# Altium project Organoid Sensing Silicon Wafer Design.PrjPcb
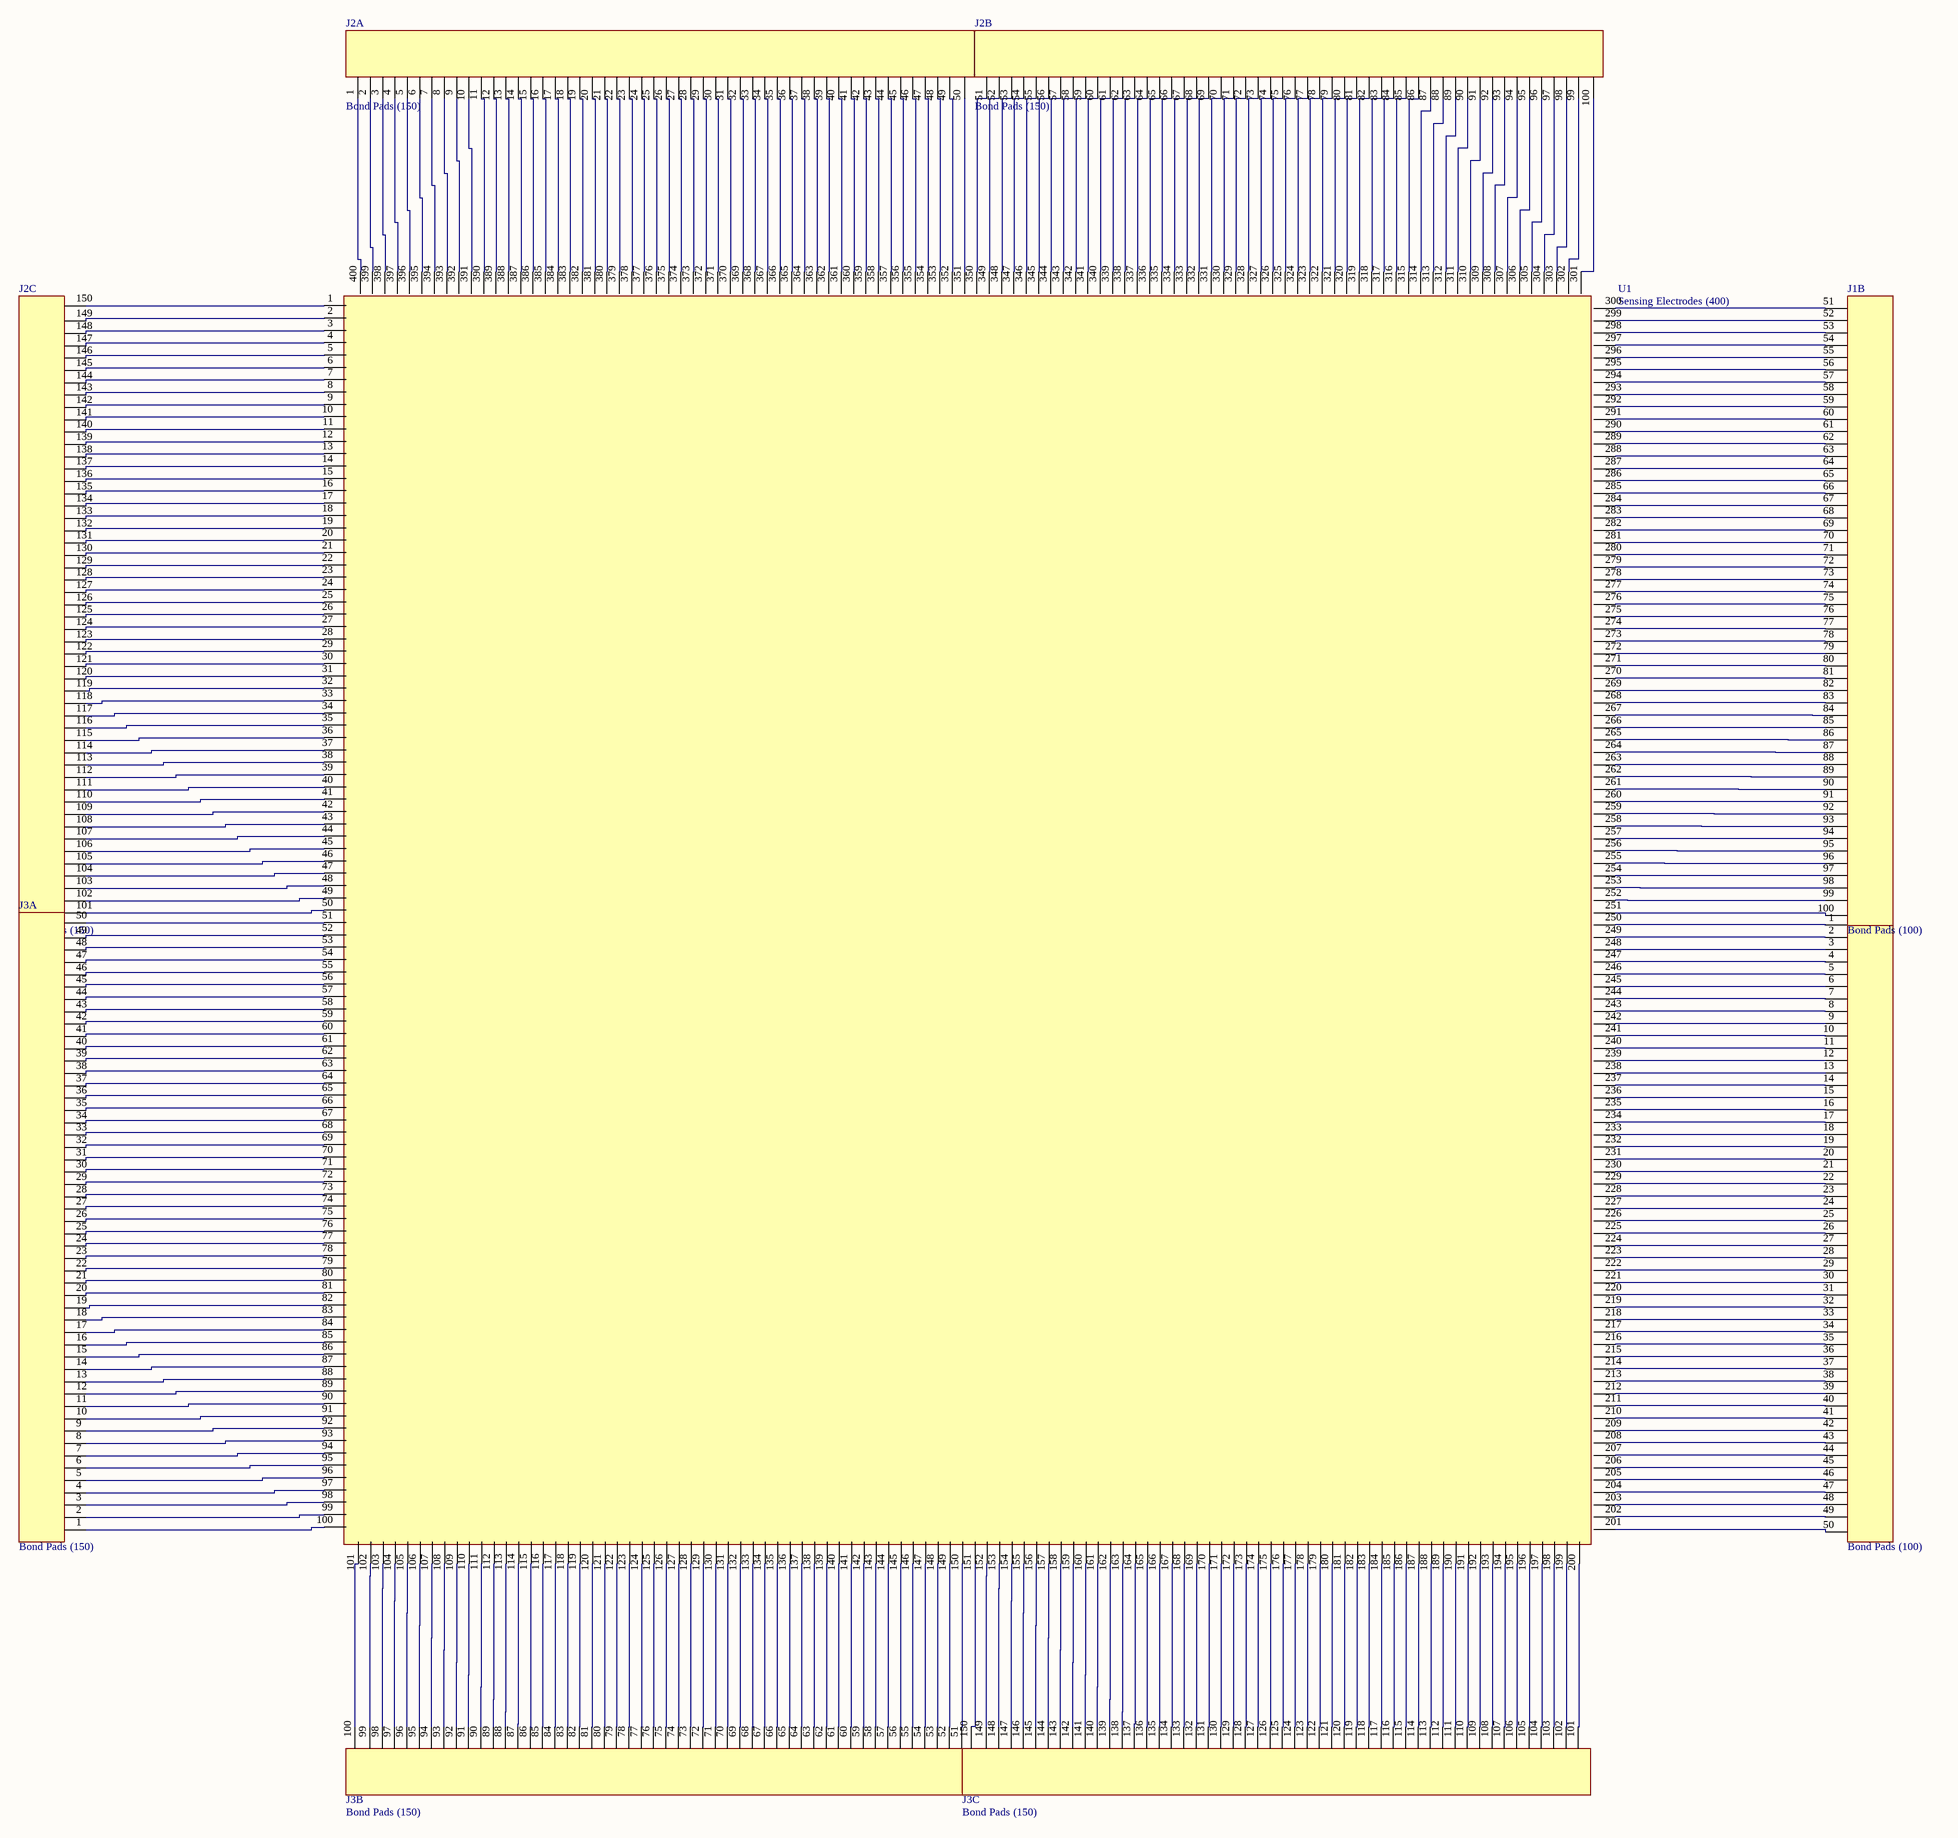
[diagram p0: Wafer Schematic.SchDoc]
1 sheet, 4 parts. Net scope: global (net labels, ports and power ports of the same name join across sheets).
Board file: WaferPCB.PcbDoc

## Sheet Wafer Schematic.SchDoc
size E; SheetNumber: 1; SheetTotal: 1

### Parts
J1  Bond Pads (100)  [BOND PADS (100)]  (parts A,B of 2)
J2  Bond Pads (150)  [BOND PADS (150)]  (parts A,B,C of 3)
J3  Bond Pads (150)  [BOND PADS (150)]  (parts A,B,C of 3)
U1  Sensing Electrodes (400)  [LGA400C100P20X20_2000X2000X0]

### Nets
NetJ1_1: J1.1 U1.250
NetJ1_2: J1.2 U1.249
NetJ1_3: J1.3 U1.248
NetJ1_4: J1.4 U1.247
NetJ1_5: J1.5 U1.246
NetJ1_6: J1.6 U1.245
NetJ1_7: J1.7 U1.244
NetJ1_8: J1.8 U1.243
NetJ1_9: J1.9 U1.242
NetJ1_10: J1.10 U1.241
NetJ1_11: J1.11 U1.240
NetJ1_12: J1.12 U1.239
NetJ1_13: J1.13 U1.238
NetJ1_14: J1.14 U1.237
NetJ1_15: J1.15 U1.236
NetJ1_16: J1.16 U1.235
NetJ1_17: J1.17 U1.234
NetJ1_18: J1.18 U1.233
NetJ1_19: J1.19 U1.232
NetJ1_20: J1.20 U1.231
NetJ1_21: J1.21 U1.230
NetJ1_22: J1.22 U1.229
NetJ1_23: J1.23 U1.228
NetJ1_24: J1.24 U1.227
NetJ1_25: J1.25 U1.226
NetJ1_26: J1.26 U1.225
NetJ1_27: J1.27 U1.224
NetJ1_28: J1.28 U1.223
NetJ1_29: J1.29 U1.222
NetJ1_30: J1.30 U1.221
NetJ1_31: J1.31 U1.220
NetJ1_32: J1.32 U1.219
NetJ1_33: J1.33 U1.218
NetJ1_34: J1.34 U1.217
NetJ1_35: J1.35 U1.216
NetJ1_36: J1.36 U1.215
NetJ1_37: J1.37 U1.214
NetJ1_38: J1.38 U1.213
NetJ1_39: J1.39 U1.212
NetJ1_40: J1.40 U1.211
NetJ1_41: J1.41 U1.210
NetJ1_42: J1.42 U1.209
NetJ1_43: J1.43 U1.208
NetJ1_44: J1.44 U1.207
NetJ1_45: J1.45 U1.206
NetJ1_46: J1.46 U1.205
NetJ1_47: J1.47 U1.204
NetJ1_48: J1.48 U1.203
NetJ1_49: J1.49 U1.202
NetJ1_50: J1.50 U1.201
NetJ1_51: J1.51 U1.300
NetJ1_52: J1.52 U1.299
NetJ1_53: J1.53 U1.298
NetJ1_54: J1.54 U1.297
NetJ1_55: J1.55 U1.296
NetJ1_56: J1.56 U1.295
NetJ1_57: J1.57 U1.294
NetJ1_58: J1.58 U1.293
NetJ1_59: J1.59 U1.292
NetJ1_60: J1.60 U1.291
NetJ1_61: J1.61 U1.290
NetJ1_62: J1.62 U1.289
NetJ1_63: J1.63 U1.288
NetJ1_64: J1.64 U1.287
NetJ1_65: J1.65 U1.286
NetJ1_66: J1.66 U1.285
NetJ1_67: J1.67 U1.284
NetJ1_68: J1.68 U1.283
NetJ1_69: J1.69 U1.282
NetJ1_70: J1.70 U1.281
NetJ1_71: J1.71 U1.280
NetJ1_72: J1.72 U1.279
NetJ1_73: J1.73 U1.278
NetJ1_74: J1.74 U1.277
NetJ1_75: J1.75 U1.276
NetJ1_76: J1.76 U1.275
NetJ1_77: J1.77 U1.274
NetJ1_78: J1.78 U1.273
NetJ1_79: J1.79 U1.272
NetJ1_80: J1.80 U1.271
NetJ1_81: J1.81 U1.270
NetJ1_82: J1.82 U1.269
NetJ1_83: J1.83 U1.268
NetJ1_84: J1.84 U1.267
NetJ1_85: J1.85 U1.266
NetJ1_86: J1.86 U1.265
NetJ1_87: J1.87 U1.264
NetJ1_88: J1.88 U1.263
NetJ1_89: J1.89 U1.262
NetJ1_90: J1.90 U1.261
NetJ1_91: J1.91 U1.260
NetJ1_92: J1.92 U1.259
NetJ1_93: J1.93 U1.258
NetJ1_94: J1.94 U1.257
NetJ1_95: J1.95 U1.256
NetJ1_96: J1.96 U1.255
NetJ1_97: J1.97 U1.254
NetJ1_98: J1.98 U1.253
NetJ1_99: J1.99 U1.252
NetJ1_100: J1.100 U1.251
NetJ2_1: J2.1 U1.400
NetJ2_2: J2.2 U1.399
NetJ2_3: J2.3 U1.398
NetJ2_4: J2.4 U1.397
NetJ2_5: J2.5 U1.396
NetJ2_6: J2.6 U1.395
NetJ2_7: J2.7 U1.394
NetJ2_8: J2.8 U1.393
NetJ2_9: J2.9 U1.392
NetJ2_10: J2.10 U1.391
NetJ2_11: J2.11 U1.390
NetJ2_12: J2.12 U1.389
NetJ2_13: J2.13 U1.388
NetJ2_14: J2.14 U1.387
NetJ2_15: J2.15 U1.386
NetJ2_16: J2.16 U1.385
NetJ2_17: J2.17 U1.384
NetJ2_18: J2.18 U1.383
NetJ2_19: J2.19 U1.382
NetJ2_20: J2.20 U1.381
NetJ2_21: J2.21 U1.380
NetJ2_22: J2.22 U1.379
NetJ2_23: J2.23 U1.378
NetJ2_24: J2.24 U1.377
NetJ2_25: J2.25 U1.376
NetJ2_26: J2.26 U1.375
NetJ2_27: J2.27 U1.374
NetJ2_28: J2.28 U1.373
NetJ2_29: J2.29 U1.372
NetJ2_30: J2.30 U1.371
NetJ2_31: J2.31 U1.370
NetJ2_32: J2.32 U1.369
NetJ2_33: J2.33 U1.368
NetJ2_34: J2.34 U1.367
NetJ2_35: J2.35 U1.366
NetJ2_36: J2.36 U1.365
NetJ2_37: J2.37 U1.364
NetJ2_38: J2.38 U1.363
NetJ2_39: J2.39 U1.362
NetJ2_40: J2.40 U1.361
NetJ2_41: J2.41 U1.360
NetJ2_42: J2.42 U1.359
NetJ2_43: J2.43 U1.358
NetJ2_44: J2.44 U1.357
NetJ2_45: J2.45 U1.356
NetJ2_46: J2.46 U1.355
NetJ2_47: J2.47 U1.354
NetJ2_48: J2.48 U1.353
NetJ2_49: J2.49 U1.352
NetJ2_50: J2.50 U1.351
NetJ2_51: J2.51 U1.350
NetJ2_52: J2.52 U1.349
NetJ2_53: J2.53 U1.348
NetJ2_54: J2.54 U1.347
NetJ2_55: J2.55 U1.346
NetJ2_56: J2.56 U1.345
NetJ2_57: J2.57 U1.344
NetJ2_58: J2.58 U1.343
NetJ2_59: J2.59 U1.342
NetJ2_60: J2.60 U1.341
NetJ2_61: J2.61 U1.340
NetJ2_62: J2.62 U1.339
NetJ2_63: J2.63 U1.338
NetJ2_64: J2.64 U1.337
NetJ2_65: J2.65 U1.336
NetJ2_66: J2.66 U1.335
NetJ2_67: J2.67 U1.334
NetJ2_68: J2.68 U1.333
NetJ2_69: J2.69 U1.332
NetJ2_70: J2.70 U1.331
NetJ2_71: J2.71 U1.330
NetJ2_72: J2.72 U1.329
NetJ2_73: J2.73 U1.328
NetJ2_74: J2.74 U1.327
NetJ2_75: J2.75 U1.326
NetJ2_76: J2.76 U1.325
NetJ2_77: J2.77 U1.324
NetJ2_78: J2.78 U1.323
NetJ2_79: J2.79 U1.322
NetJ2_80: J2.80 U1.321
NetJ2_81: J2.81 U1.320
NetJ2_82: J2.82 U1.319
NetJ2_83: J2.83 U1.318
NetJ2_84: J2.84 U1.317
NetJ2_85: J2.85 U1.316
NetJ2_86: J2.86 U1.315
NetJ2_87: J2.87 U1.314
NetJ2_88: J2.88 U1.313
NetJ2_89: J2.89 U1.312
NetJ2_90: J2.90 U1.311
NetJ2_91: J2.91 U1.310
NetJ2_92: J2.92 U1.309
NetJ2_93: J2.93 U1.308
NetJ2_94: J2.94 U1.307
NetJ2_95: J2.95 U1.306
NetJ2_96: J2.96 U1.305
NetJ2_97: J2.97 U1.304
NetJ2_98: J2.98 U1.303
NetJ2_99: J2.99 U1.302
NetJ2_100: J2.100 U1.301
NetJ2_101: J2.101 U1.50
NetJ2_102: J2.102 U1.49
NetJ2_103: J2.103 U1.48
NetJ2_104: J2.104 U1.47
NetJ2_105: J2.105 U1.46
NetJ2_106: J2.106 U1.45
NetJ2_107: J2.107 U1.44
NetJ2_108: J2.108 U1.43
NetJ2_109: J2.109 U1.42
NetJ2_110: J2.110 U1.41
NetJ2_111: J2.111 U1.40
NetJ2_112: J2.112 U1.39
NetJ2_113: J2.113 U1.38
NetJ2_114: J2.114 U1.37
NetJ2_115: J2.115 U1.36
NetJ2_116: J2.116 U1.35
NetJ2_117: J2.117 U1.34
NetJ2_118: J2.118 U1.33
NetJ2_119: J2.119 U1.32
NetJ2_120: J2.120 U1.31
NetJ2_121: J2.121 U1.30
NetJ2_122: J2.122 U1.29
NetJ2_123: J2.123 U1.28
NetJ2_124: J2.124 U1.27
NetJ2_125: J2.125 U1.26
NetJ2_126: J2.126 U1.25
NetJ2_127: J2.127 U1.24
NetJ2_128: J2.128 U1.23
NetJ2_129: J2.129 U1.22
NetJ2_130: J2.130 U1.21
NetJ2_131: J2.131 U1.20
NetJ2_132: J2.132 U1.19
NetJ2_133: J2.133 U1.18
NetJ2_134: J2.134 U1.17
NetJ2_135: J2.135 U1.16
NetJ2_136: J2.136 U1.15
NetJ2_137: J2.137 U1.14
NetJ2_138: J2.138 U1.13
NetJ2_139: J2.139 U1.12
NetJ2_140: J2.140 U1.11
NetJ2_141: J2.141 U1.10
NetJ2_142: J2.142 U1.9
NetJ2_143: J2.143 U1.8
NetJ2_144: J2.144 U1.7
NetJ2_145: J2.145 U1.6
NetJ2_146: J2.146 U1.5
NetJ2_147: J2.147 U1.4
NetJ2_148: J2.148 U1.3
NetJ2_149: J2.149 U1.2
NetJ2_150: J2.150 U1.1
NetJ3_1: J3.1 U1.100
NetJ3_2: J3.2 U1.99
NetJ3_3: J3.3 U1.98
NetJ3_4: J3.4 U1.97
NetJ3_5: J3.5 U1.96
NetJ3_6: J3.6 U1.95
NetJ3_7: J3.7 U1.94
NetJ3_8: J3.8 U1.93
NetJ3_9: J3.9 U1.92
NetJ3_10: J3.10 U1.91
NetJ3_11: J3.11 U1.90
NetJ3_12: J3.12 U1.89
NetJ3_13: J3.13 U1.88
NetJ3_14: J3.14 U1.87
NetJ3_15: J3.15 U1.86
NetJ3_16: J3.16 U1.85
NetJ3_17: J3.17 U1.84
NetJ3_18: J3.18 U1.83
NetJ3_19: J3.19 U1.82
NetJ3_20: J3.20 U1.81
NetJ3_21: J3.21 U1.80
NetJ3_22: J3.22 U1.79
NetJ3_23: J3.23 U1.78
NetJ3_24: J3.24 U1.77
NetJ3_25: J3.25 U1.76
NetJ3_26: J3.26 U1.75
NetJ3_27: J3.27 U1.74
NetJ3_28: J3.28 U1.73
NetJ3_29: J3.29 U1.72
NetJ3_30: J3.30 U1.71
NetJ3_31: J3.31 U1.70
NetJ3_32: J3.32 U1.69
NetJ3_33: J3.33 U1.68
NetJ3_34: J3.34 U1.67
NetJ3_35: J3.35 U1.66
NetJ3_36: J3.36 U1.65
NetJ3_37: J3.37 U1.64
NetJ3_38: J3.38 U1.63
NetJ3_39: J3.39 U1.62
NetJ3_40: J3.40 U1.61
NetJ3_41: J3.41 U1.60
NetJ3_42: J3.42 U1.59
NetJ3_43: J3.43 U1.58
NetJ3_44: J3.44 U1.57
NetJ3_45: J3.45 U1.56
NetJ3_46: J3.46 U1.55
NetJ3_47: J3.47 U1.54
NetJ3_48: J3.48 U1.53
NetJ3_49: J3.49 U1.52
NetJ3_50: J3.50 U1.51
NetJ3_51: J3.51 U1.150
NetJ3_52: J3.52 U1.149
NetJ3_53: J3.53 U1.148
NetJ3_54: J3.54 U1.147
NetJ3_55: J3.55 U1.146
NetJ3_56: J3.56 U1.145
NetJ3_57: J3.57 U1.144
NetJ3_58: J3.58 U1.143
NetJ3_59: J3.59 U1.142
NetJ3_60: J3.60 U1.141
NetJ3_61: J3.61 U1.140
NetJ3_62: J3.62 U1.139
NetJ3_63: J3.63 U1.138
NetJ3_64: J3.64 U1.137
NetJ3_65: J3.65 U1.136
NetJ3_66: J3.66 U1.135
NetJ3_67: J3.67 U1.134
NetJ3_68: J3.68 U1.133
NetJ3_69: J3.69 U1.132
NetJ3_70: J3.70 U1.131
NetJ3_71: J3.71 U1.130
NetJ3_72: J3.72 U1.129
NetJ3_73: J3.73 U1.128
NetJ3_74: J3.74 U1.127
NetJ3_75: J3.75 U1.126
NetJ3_76: J3.76 U1.125
NetJ3_77: J3.77 U1.124
NetJ3_78: J3.78 U1.123
NetJ3_79: J3.79 U1.122
NetJ3_80: J3.80 U1.121
NetJ3_81: J3.81 U1.120
NetJ3_82: J3.82 U1.119
NetJ3_83: J3.83 U1.118
NetJ3_84: J3.84 U1.117
NetJ3_85: J3.85 U1.116
NetJ3_86: J3.86 U1.115
NetJ3_87: J3.87 U1.114
NetJ3_88: J3.88 U1.113
NetJ3_89: J3.89 U1.112
NetJ3_90: J3.90 U1.111
NetJ3_91: J3.91 U1.110
NetJ3_92: J3.92 U1.109
NetJ3_93: J3.93 U1.108
NetJ3_94: J3.94 U1.107
NetJ3_95: J3.95 U1.106
NetJ3_96: J3.96 U1.105
NetJ3_97: J3.97 U1.104
NetJ3_98: J3.98 U1.103
NetJ3_99: J3.99 U1.102
NetJ3_100: J3.100 U1.101
NetJ3_101: J3.101 U1.200
NetJ3_102: J3.102 U1.199
NetJ3_103: J3.103 U1.198
NetJ3_104: J3.104 U1.197
NetJ3_105: J3.105 U1.196
NetJ3_106: J3.106 U1.195
NetJ3_107: J3.107 U1.194
NetJ3_108: J3.108 U1.193
NetJ3_109: J3.109 U1.192
NetJ3_110: J3.110 U1.191
NetJ3_111: J3.111 U1.190
NetJ3_112: J3.112 U1.189
NetJ3_113: J3.113 U1.188
NetJ3_114: J3.114 U1.187
NetJ3_115: J3.115 U1.186
NetJ3_116: J3.116 U1.185
NetJ3_117: J3.117 U1.184
NetJ3_118: J3.118 U1.183
NetJ3_119: J3.119 U1.182
NetJ3_120: J3.120 U1.181
NetJ3_121: J3.121 U1.180
NetJ3_122: J3.122 U1.179
NetJ3_123: J3.123 U1.178
NetJ3_124: J3.124 U1.177
NetJ3_125: J3.125 U1.176
NetJ3_126: J3.126 U1.175
NetJ3_127: J3.127 U1.174
NetJ3_128: J3.128 U1.173
NetJ3_129: J3.129 U1.172
NetJ3_130: J3.130 U1.171
NetJ3_131: J3.131 U1.170
NetJ3_132: J3.132 U1.169
NetJ3_133: J3.133 U1.168
NetJ3_134: J3.134 U1.167
NetJ3_135: J3.135 U1.166
NetJ3_136: J3.136 U1.165
NetJ3_137: J3.137 U1.164
NetJ3_138: J3.138 U1.163
NetJ3_139: J3.139 U1.162
NetJ3_140: J3.140 U1.161
NetJ3_141: J3.141 U1.160
NetJ3_142: J3.142 U1.159
NetJ3_143: J3.143 U1.158
NetJ3_144: J3.144 U1.157
NetJ3_145: J3.145 U1.156
NetJ3_146: J3.146 U1.155
NetJ3_147: J3.147 U1.154
NetJ3_148: J3.148 U1.153
NetJ3_149: J3.149 U1.152
NetJ3_150: J3.150 U1.151

### Library data of the parts
J1 = Bond Pads (100): 100 pads for the shorter side of the chip; Part Number: Bond Pads (100)
J2 J3 = Bond Pads (150): 150 pads for the longer side of the chip; Part Number: Bond Pads (150)
U1 = Silicon Die Holder 400 Electrodes: 400 Electrodes covering a 2 mm by 2 mm sensing 10x; Part Number: Silicon Die Holder 400 Electrodes